# EasyEDA schematic SCH_SIT210 Task 7.3D PCB_2022-06-06.json
TITLE: TASK101.HD PCB for Task 7.3D; REV: 1.0; Date: 2022-06-06; Sheet: 1/1; Drawn By: josh.kilinc; Company: SIT210 - Deakin University
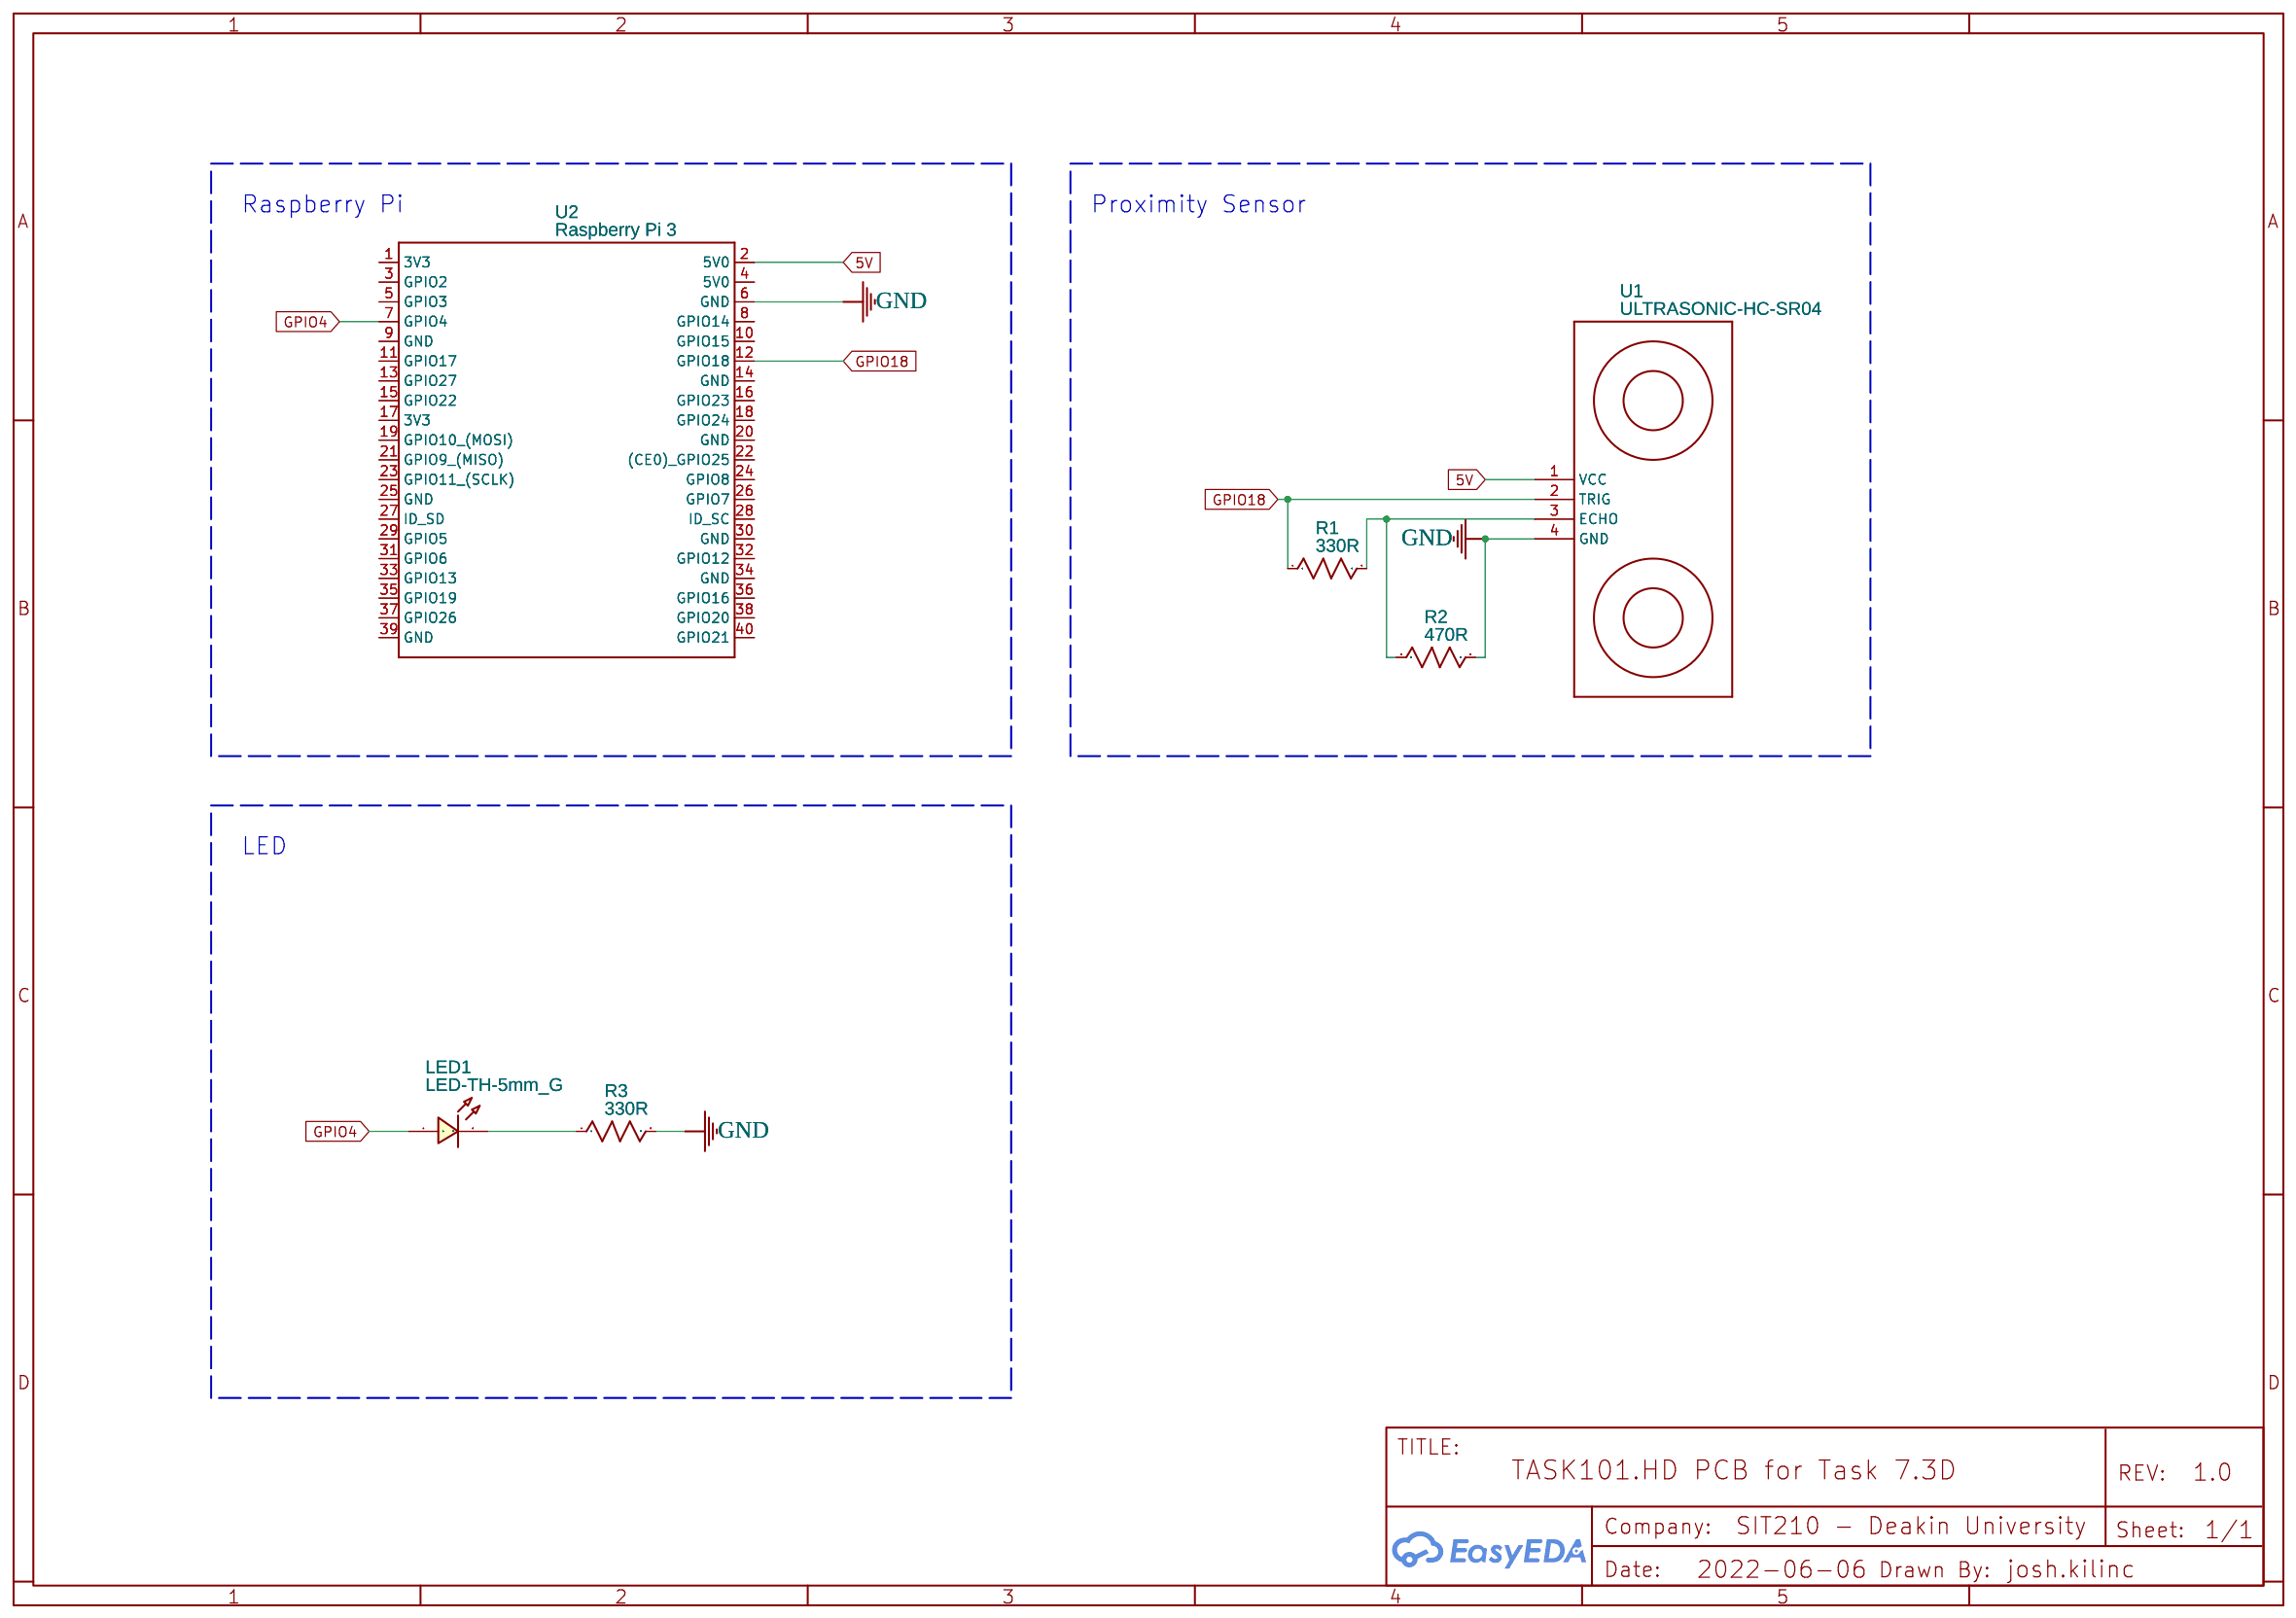
[diagram p0: schematic sheet]

## Parts
LED1  LED-TH-5mm_G  [LED-TH_BD5.0_GREEN]
R1  330R  [R0603]
R2  470R  [R0603]
R3  330R  [R0603]
U1  ULTRASONIC-HC-SR04  [ULTRASONIC-HC-SR04]
U2  Raspberry Pi 3  [RASPBERRYPI_3_DIMENSIONS]

## Library data of the parts
LED1 = LED-TH-5mm_G: Manufacturer: EVERLIGHT(台湾亿光); Manufacturer Part: 333-2SYGD/S530-E2; Supplier Part: C88163; Supplier: LCSC; Contributor: LCEDA_Lib
R1-R3 = R_0603_US: Contributor: LCEDA_Lib
U1 = ULTRASONIC-HC-SR04: Ultrasonic Ranging Module HC-SR04
U2 = Raspberry Pi 3: Manufacturer: RaspberryPi.org; Supplier: RaspberryPi.org; Supplier Part: RaspberryPi 3; link: RaspberryPi.org; Contributor: willp1203

## Nets
5V: U1.1(VCC) U2.2(5V0)
GND: R2.2 R3.2 U1.4(GND) U2.6(GND)
GPIO4: LED1.1 U2.7(GPIO4)
GPIO18: R1.1 U1.2(TRIG) U2.12(GPIO18)
Net-(LED1-2): LED1.2 R3.1
Net-(R1-2): R1.2 R2.1 U1.3(ECHO)

Not connected (* = marked no-connect by the designer): U2 1(3V3) 3(GPIO2) 4(5V0) 5(GPIO3) 8(GPIO14) 9(GND) 10(GPIO15) 11(GPIO17) 13(GPIO27) 14(GND) 15(GPIO22) 16(GPIO23) 17(3V3) 18(GPIO24) 19(GPIO10 (MOSI)) 20(GND) 21(GPIO9 (MISO)) 22((CE0) GPIO25) 23(GPIO11 (SCLK)) 24(GPIO8) 25(GND) 26(GPIO7) 27(ID_SD) 28(ID_SC) 29(GPIO5) 30(GND) 31(GPIO6) 32(GPIO12) 33(GPIO13) 34(GND) 35(GPIO19) 36(GPIO16) 37(GPIO26) 38(GPIO20) 39(GND) 40(GPIO21)

## Notes on the sheet
- Raspberry Pi
- Proximity Sensor
- LED
